# Altium schematic sheet in_channel.SchDoc
size A4; SheetNumber: 7; SheetTotal: 7; NameOfSheet: PWM channels
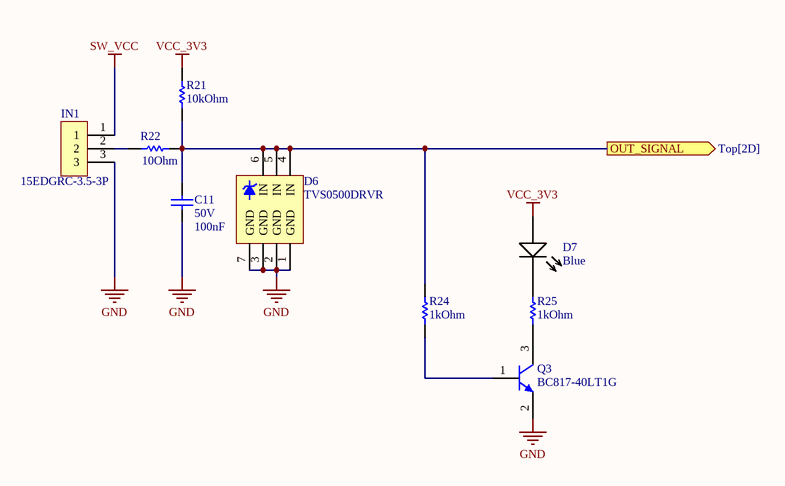
[diagram p0: in_channel.SchDoc]

## Parts
C11  Voltage: 50V  Capacitance: 100nF  [CAP_0603_High_density]
D6  TVS0500DRVR  [FP-DRV0006A-IPC_C]
D7  Colour: Blue  [LED_0603]  (hidden comment: C84266)
IN1  15EDGRC-3.5-3P  [15EDGRC-3.5 - 3 PIN]
Q3  BC817-40LT1G  [SOT-23A]
R21  Resistance: 10kOhm  [RES_0603]  (hidden comment: 0603 10kOhm 1%)
R22  Resistance: 10Ohm  [RES_0603]  (hidden comment: 0603 10Ohm 1%)
R24  Resistance: 1kOhm  [RES_0603]  (hidden comment: 0603 1kOhm 1%)
R25  Resistance: 1kOhm  [RES_0603]  (hidden comment: 0603 1kOhm 1%)

## Ports
OUT_SIGNAL (out, see Top[2D])

## Nets
GND: C11.2 D6.1(GND) D6.2(GND) D6.3(GND) D6.7(GND) IN1.3 Q3.2(E)
SW_VCC: IN1.1
VCC_3V3: D7.A R21.1
OUT_SIGNAL: C11.1 D6.4(IN) D6.5(IN) D6.6(IN) R21.2 R22.2 R24.2 ; port OUT_SIGNAL
NetD7_C: D7.C R25.2
NetIN1_2: IN1.2 R22.1
NetQ3_1: Q3.1 R24.1
NetQ3_3: Q3.3(C) R25.1

## Notes on the sheet
- Author:
- Sheet:
- /
- Issue date:
- Project name:
- Revision:
- Date:
- Page name:

## Library data of the parts
C11 = Capacitor SMD: Generic Ceramic Capacitor SMD; Temperature Coefficient: X7R; Tolerance: 10%; Package: 0603; Supplier 1: LCSC; Supplier Part Number 1: C282519
D6 = TVS0500DRVR: ESD Suppressors / TVS Diodes 5V flat-clamp surge protection device 6-WSON -40 to 125; Supplier 1: Digi-Key; Supplier Part Number 1: 296-48382-1-ND
D7 = LED diode: Generic LED diode SMD Blue; Forward current: 0mA; Forward Voltage: 0V; Manufacturer Part Number: C84266; Supplier 1: LCSC; Supplier Part Number 1: C84266
IN1 = 15EDGRC-3.5-3P: 15EDGRC-3.5 - 3 pin; Manufacturer Part Number: 15EDGRC-3.5-3P; Supplier 1: LCSC; Supplier Part Number 1: C880573
Q3 = BC817-40LT1G: General Purpose Transistor, NPN Silicon, 3-Pin SOT-23, Pb-Free, Tape and Reel; Manufacturer: On Semiconductor; fT Min (MHz): 100; IC Continuous (A): 0.5; ComponentLink2URL: http://www.onsemi.com/pub_link/Collateral/BC817-16LT1-D.PDF; DatasheetVersion: Rev. 12; ComponentLink3URL: http://www.onsemi.cn/pub_link/Collateral/318-08.PDF; ComponentLink3Description: Package Specification; ComponentLink1Description: Manufacturer URL; Mounting Technology: Surface Mount; ComponentLink1URL: http://www.onsemi.com/; Packing: Tape and Reel; ComponentLink2Description: Datasheet; Polarity: NPN; RoHS: TRUE; PackageVersion: Rev. AP, 11/2009; PartNumber: BC817-40LT1G; PackageDescription: 3-Pin Small Outline Transistor, Body 2.92 x 1.3 mm, Pitch 0.95 mm; PackageReference: SOT-23-3-318-08; Supplier 1: LCSC; Supplier Part Number 1: C94412
R21 R22 R24 R25 = Resistor SMD_1: Generic Resistor SMD; Supplier 1: LCSC
  R21: Manufacturer Part Number: 0603 10kOhm 1%; Supplier Part Number 1: C3017715
  R22: Manufacturer Part Number: 0603 10Ohm 1%; Supplier Part Number 1: C22859
  R24 R25: Manufacturer Part Number: 0603 1kOhm 1%; Supplier Part Number 1: C3016283